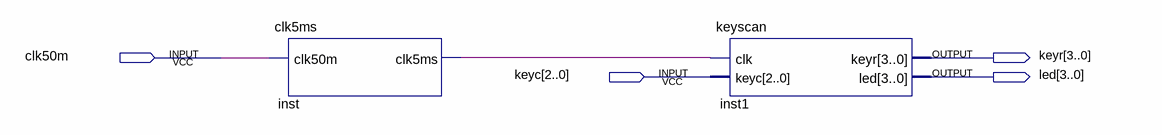
[diagram p0: schematic sheet]
// Quartus schematic Block1.bdf as structural Verilog: 2 symbols, 4 pins
module Block1 (
  input  clk50m,
  input  [2:0] keyc,
  output [3:0] keyr,
  output [3:0] led
);

  wire inst_clk5ms;

  clk5ms inst (.clk50m(clk50m), .clk5ms(inst_clk5ms));
  keyscan inst1 (.clk(inst_clk5ms), .keyc(keyc), .keyr(keyr), .led(led));
endmodule
